# Altium schematic sheet MP1484_with_5V_Output.SchDoc
size A4
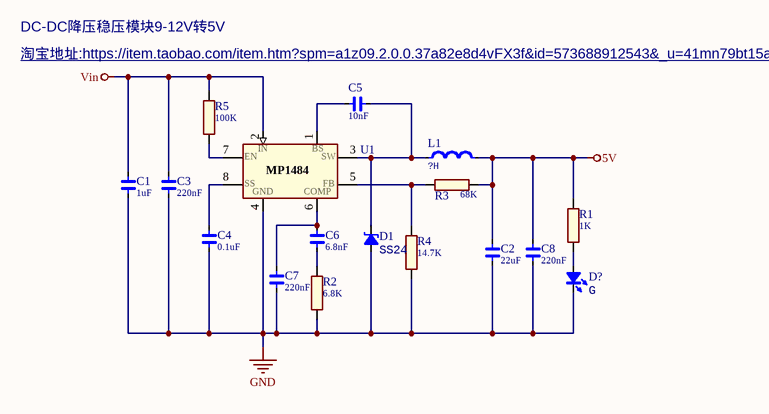
[diagram p0: MP1484_with_5V_Output.SchDoc]

## Parts
C1  value 1uF  [CAP_0805]  (hidden comment: Cap)
C2  value 22uF  [CAP_0805]  (hidden comment: Cap)
C3  value 220nF  [CAP_0603]  (hidden comment: Cap)
C4  value 0.1uF  [CAP_0603]  (hidden comment: Cap)
C5  value 10nF  [CAP_0603]  (hidden comment: Cap)
C6  value 6.8nF  [CAP_0603]  (hidden comment: Cap)
C7  value 220nF  [CAP_0603]  (hidden comment: Cap)
C8  value 220nF  [CAP_0603]  (hidden comment: Cap)
D1  SS24  [DO-214AC]
D?  G  [LED_0603]
L1  value ?H  [IND_CDRH74]  (hidden comment: Ind)
R1  value 1K  [RES_0603]  (hidden comment: Res)
R2  value 6.8K  [RES_0603]  (hidden comment: Res)
R3  value 68K  [RES_0603]  (hidden comment: Res)
R4  value 14.7K  [RES_0603]  (hidden comment: Res)
R5  value 100K  [RES_0603]  (hidden comment: Res)
U1  MP1484  [SOIC8N]  (value not drawn)

## Nets
5V: C2.2 C8.1 L1.2 R1.1 R3.1
GND: C1.1 C2.1 C3.1 C4.1 C7.2 C8.2 D1.1(A) D?.2(K) R2.2 R4.2 U1.4(GND)
Vin: C1.2 C3.2 R5.1 U1.2(IN)
NetC4_2: C4.2 U1.8(SS)
NetC5_1: C5.1 D1.2(K) L1.1 U1.3(SW)
NetC5_2: C5.2 U1.1(BS)
NetC6_1: C6.1 C7.1 U1.6(IN)
NetC6_2: C6.2 R2.1
NetD?_1: D?.1(A) R1.2
NetR3_2: R3.2 R4.1 U1.5(FB)
NetR5_2: R5.2 U1.7(EN)

## Notes on the sheet
- DC-DC降压稳压模块9-12V转5V
- 淘宝地址:https://item.taobao.com/item.htm?spm=a1z09.2.0.0.37a82e8d4vFX3f&id=573688912543&_u=41mn79bt15a4 <https://item.taobao.com/item.htm?spm=a1z09.2.0.0.37a82e8d4vFX3f&id=573688912543&_u=41mn79bt15a4>
- (in symbol MP1484) COMP

## Library data of the parts
D1 = SchottkyDiode: Schottky Diode; Value: SS24
D? = LED: Value: G
L1 = Ind: Inductor; Specification: ±5% 100mA; Manufacturer: *
U1 = MP1484: • 3A Continuous Output Current / • Wide 4.75V to 18V Operating Input Range / • Integrated 85mΩ Power MOSFET Switches / • Output Adjustable from 0.925V to 20V / • Up to 95% Efficiency / • Programmable Soft-Start / • Stable with Low ESR Ceramic Output Capacitors / • Fixed 340KHz Frequency / • Cycle-by-Cycle Over Current Protection / • Input Under Voltage Lockout / • Thermally Enhanced 8-Pin SOIC Package